# Altium schematic sheet OC_PROT.SchDoc
size C; SheetNumber: 2; SheetTotal: 9
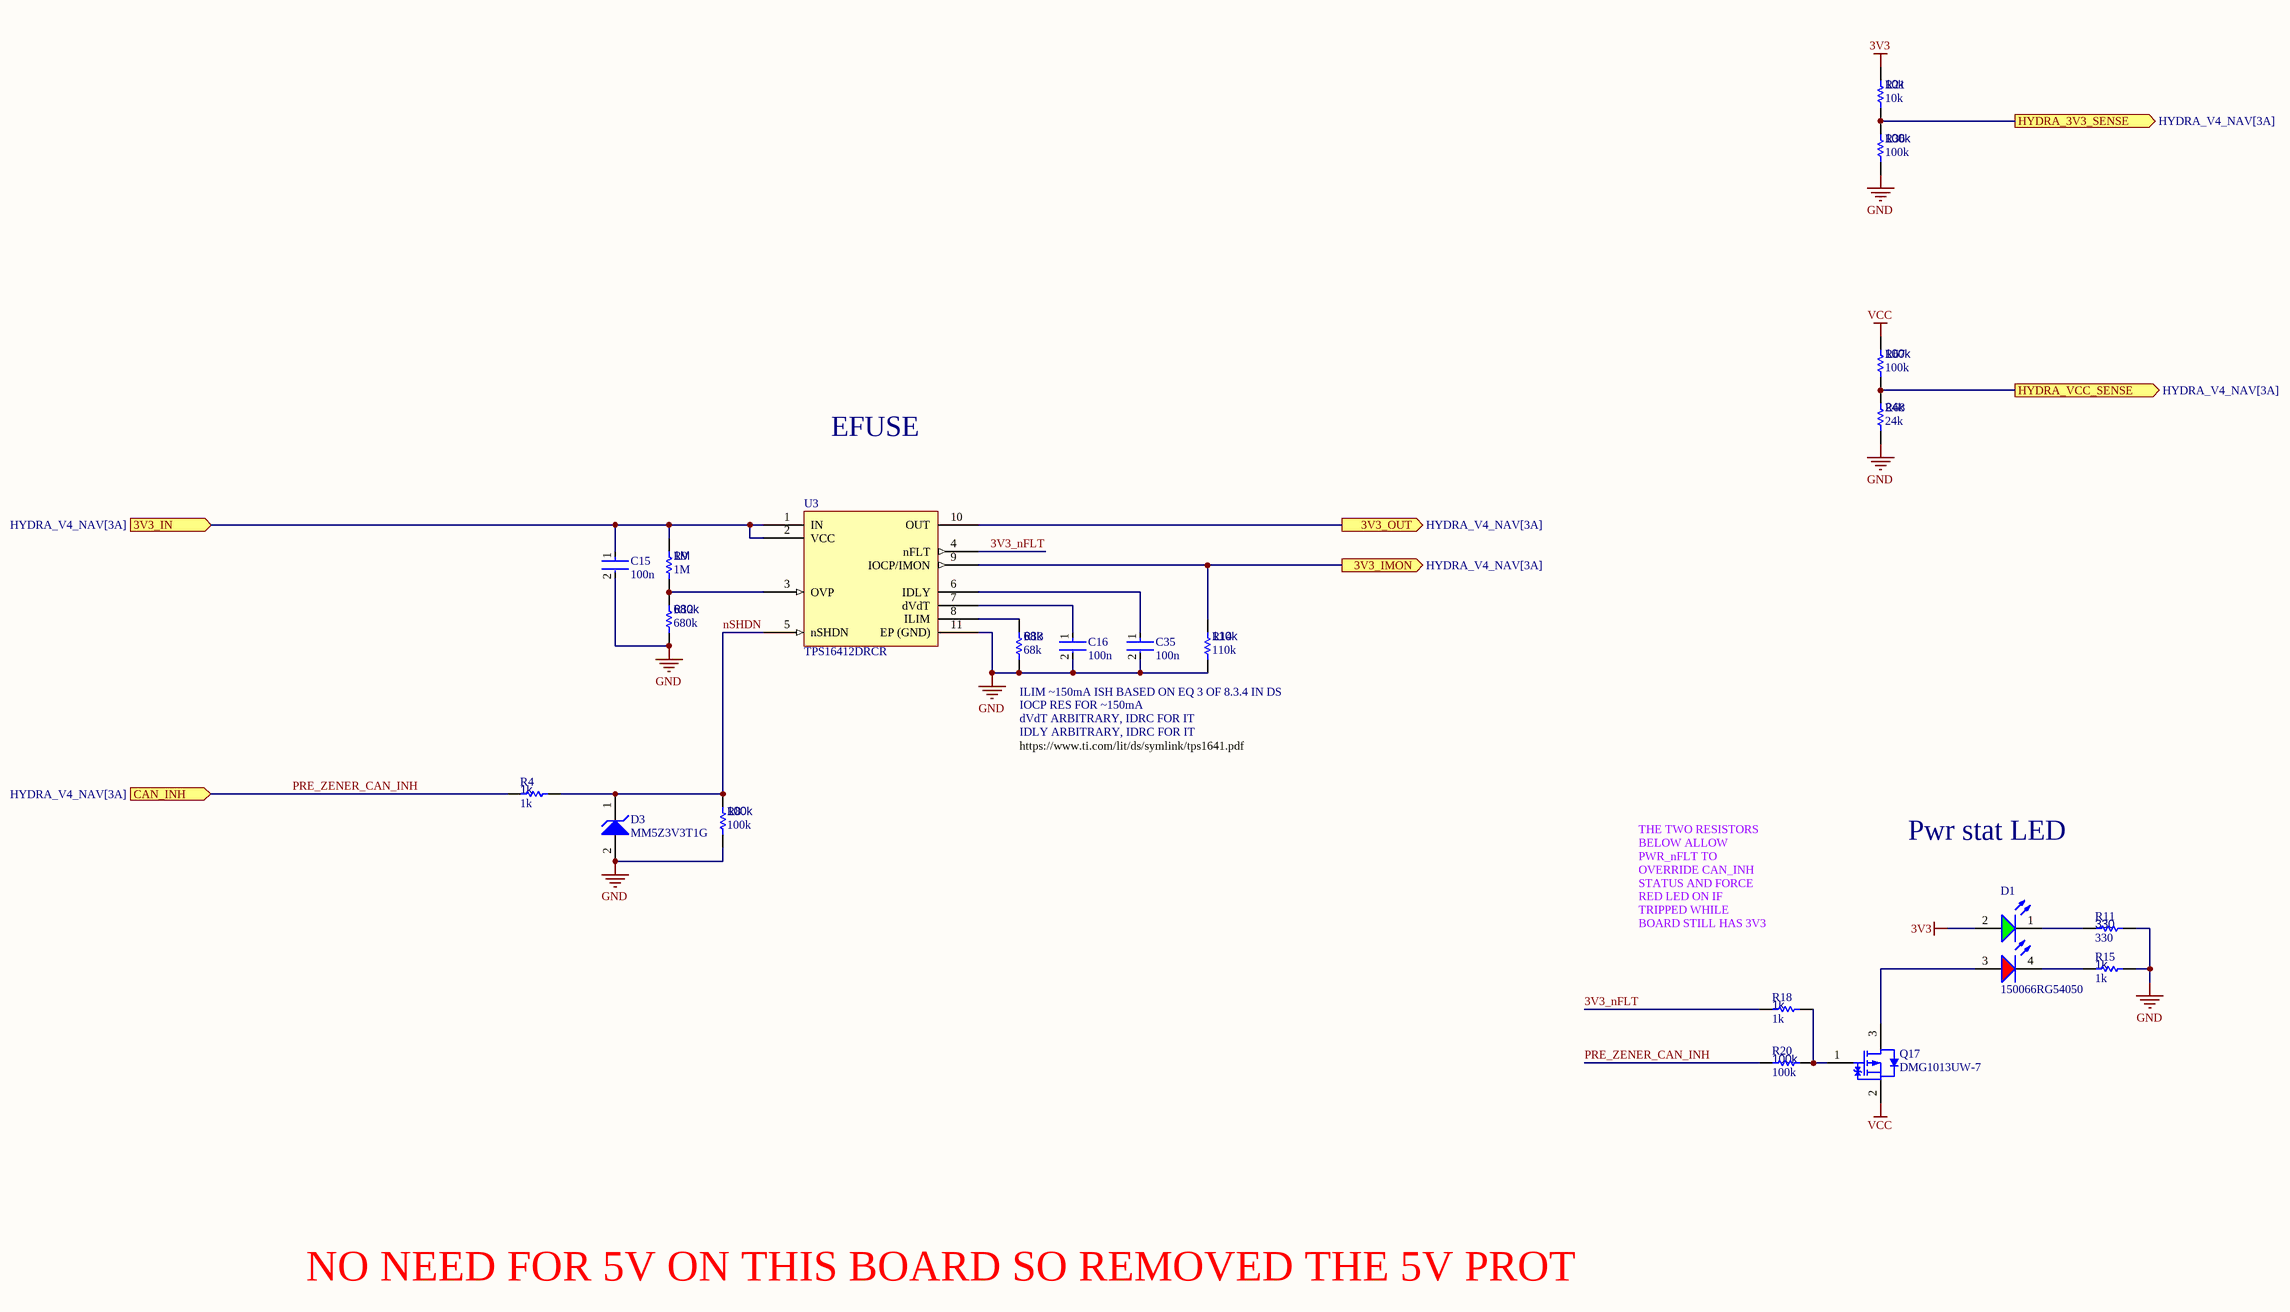
[diagram p0: OC_PROT.SchDoc]

## Parts
C15  100n  [FP-0402-L_1_0_0_05-W_0_5-IPC_A]
C16  100n  [FP-0402-L_1_0_0_05-W_0_5-IPC_A]
C35  100n  [FP-0402-L_1_0_0_05-W_0_5-IPC_A]
D1  150066RG54050  [WL-SBCD_0606]
D3  MM5Z3V3T1G  [ONSC-SOD-523-2-502-01_V]
Q17  DMG1013UW-7  [DIOD-SOT323-3_V]
R4  1k  [R0603B]
R8  100k  [R0603B]
R9  1M  [R0603B]
R11  330  [R0603B]
R12  680k  [R0603B]
R13  68k  [R0603B]
R14  110k  [R0603B]
R15  1k  [R0603B]
R18  1k  [R0603B]
R20  100k  [R0603B]
R21  10k  [R0603B]
R36  100k  [R0603B]
R67  100k  [R0603B]
R68  24k  [R0603B]
U3  TPS16412DRCR  [PSON50P300X100_HS-11N]

## Ports
3V3_IMON (out, see HYDRA_V4_NAV[3A]), 3V3_IN (in, see HYDRA_V4_NAV[3A]), 3V3_OUT (out, see HYDRA_V4_NAV[3A]), CAN_INH (in, see HYDRA_V4_NAV[3A]), HYDRA_3V3_SENSE (out, see HYDRA_V4_NAV[3A]), HYDRA_VCC_SENSE (out, see HYDRA_V4_NAV[3A])

## Nets
3V3: D1.2(A) R21.1
GND: C15.2 C16.2 C35.2 D3.2(A) R8.1 R11.1 R12.2 R13.2 R14.2 R15.1 R36.2 R68.2 U3.11(EP_(GND))
VCC: Q17.2(S) R67.1
3V3_IMON: R14.1 U3.9(IOCP/IMON) ; port 3V3_IMON
3V3_IN: C15.1 R9.1 U3.1(IN) U3.2(VCC) ; port 3V3_IN
3V3_nFLT: R18.2 U3.4(nFLT)
3V3_OUT: U3.10(OUT) ; port 3V3_OUT
HYDRA_3V3_SENSE: R21.2 R36.1 ; port HYDRA_3V3_SENSE
HYDRA_VCC_SENSE: R67.2 R68.1 ; port HYDRA_VCC_SENSE
nSHDN: D3.1(K) R4.1 R8.2 U3.5(nSHDN)
PRE_ZENER_CAN_INH: R4.2 R20.2 ; port CAN_INH
NetC16_1: C16.1 U3.7(dVdT)
NetC35_1: C35.1 U3.6(IDLY)
NetD1_1: D1.1(K) R11.2
NetD1_3: D1.3(A) Q17.3(D)
NetD1_4: D1.4(K) R15.2
NetQ17_1: Q17.1(G) R18.1 R20.1
NetR9_2: R9.2 R12.1 U3.3(OVP)
NetR13_1: R13.1 U3.8(ILIM)

## Notes on the sheet
- EFUSE
- ILIM ~150mA ISH BASED ON EQ 3 OF 8.3.4 IN DS
- dVdT ARBITRARY, IDRC FOR IT
- IOCP RES FOR ~150mA
- https://www.ti.com/lit/ds/symlink/tps1641.pdf
- IDLY ARBITRARY, IDRC FOR IT
- Pwr stat LED
- THE TWO RESISTORS BELOW ALLOW PWR_nFLT TO OVERRIDE CAN_INH STATUS AND FORCE RED LED ON IF TRIPPED WHILE BOARD STILL HAS 3V3
- NO NEED FOR 5V ON THIS BOARD SO REMOVED THE 5V PROT

## Library data of the parts
C15 C16 = CMP-001-00058-1: LARGE PADS, 0402 CAP, CHANGE COMMENT TO MATCH REAL P/N; Capacitor Type: Ceramic; Value: 100n; Min Operating Temperature: -55°C; Mounting Technology: Surface Mount; Pins: 2; Case/Package: 0402; RoHS Compliant: Yes; Max Operating Temperature: 85°C
C35 = CMP-001-00058-1: LARGE PADS, 0402 CAP, CHANGE COMMENT TO MATCH REAL P/N; Capacitor Type: Ceramic; Value: TBD; Min Operating Temperature: -55°C; Mounting Technology: Surface Mount; Pins: 2; Case/Package: 0402; RoHS Compliant: Yes; Max Operating Temperature: 85°C
D1 = CMP-004-00040-2: Led, Red/Grn, 180Mcd/230Mcd, 624Nm/525Nm Rohs Compliant: Yes; Source: rgled.SchLib; Component Type: Standard; Design Item ID: CMP-004-00034-2; Pins: 4
D3 = CMP-1060-00750-1: Zener Voltage Regulator, 500 mW, 2-Pin SOD-523, Pb-Free, Tape and Reel; Manufacturer: On Semiconductor; P Max (W): 0.5; VZ Typ (V): 3.3; RoHS: Pb-Free; ComponentLink2Description: Datasheet; PackageReference: SOD-523-2-502-01; DatasheetVersion: Rev. 10; ComponentLink1Description: Manufacturer URL; PackageVersion: Rev. E, 09/2010; ComponentLink3URL: http://www.onsemi.com/pub_link/Collateral/502-01.PDF; ComponentLink2URL: http://www.onsemi.cn/pub_link/Collateral/MM5Z2V4T1-D.PDF; Mounting Technology: Surface Mount; PartNumber: MM5Z3V3T1G; Packing: Tape and Reel; PackageDescription: 2-Pin SOD, Body 1.2 x 0.8 mm; ComponentLink1URL: http://www.onsemi.com/; ComponentLink3Description: Package Specification
Q17 = CMP-2000-06170-1: P-Channel Enhancement Mode MOSFET, 310 mW, 20 V, -55 to 150 degC, 3-Pin SOT-323, RoHS, Tape and Reel; Manufacturer: Diodes Inc; Qg Gate Charge: 0.622nC; Drain-Source On Resistance-Max: 750mO; Rated Power Dissipation: 310mW; Drain-to-Source Voltage [Vdss]: 20V; Package Reference: SOT323; Datasheet Version: Rev. 3-2, 09/2013; Package Description: 3-Pin Small Outline Transistor, Body 2 x 1.25 mm, Pitch 0.65 mm; Mounting Technology: SurfaceMount; Manufacturer URL: http://www.diodes.com/; Datasheet URL: http://www.diodes.com/_files/datasheets/ds31861.pdf; Channel Type: P-Channel
R4 R8 R9 R11-R15 R18 R20 R21 R36 R67 R68 = CMP-009-00002-14: Resistor
  R4 R15 R18: Value: 1k
  R8 R20 R36 R67: Value: 100k
  R9: Value: 1M
  R11: Value: 330
  R12: Value: 680k
  R13: Value: 68k
  R14: Value: 110k
  R21: Value: 10k
  R68: Value: 24k
U3 = CMP-019-00048-3: 2.7-V to 40-V 152-mΩ 1.8-A eFuse with output power limiting 10-VSON -40 to 125